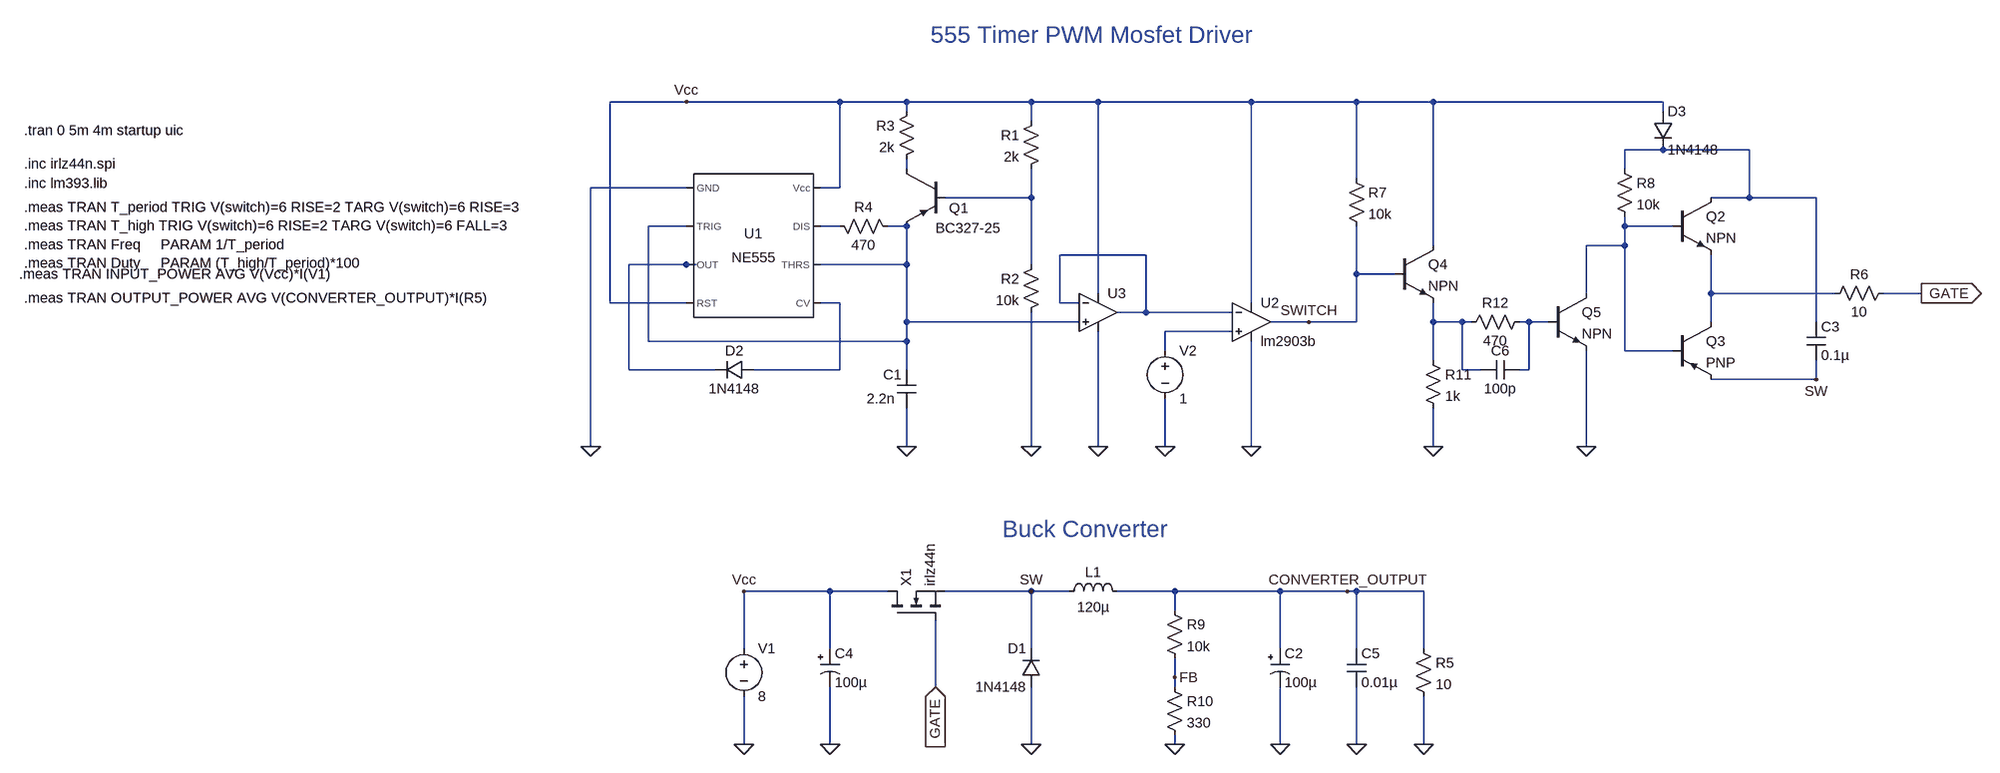
[diagram p0: schematic buck-converter.asc]
buck-converter.asc, the LTspice schematic file:
Version 4.1
SHEET 1 2688 1764
WIRE 320 64 192 64
WIRE 576 64 320 64
WIRE 688 64 576 64
WIRE 896 64 688 64
WIRE 1008 64 896 64
WIRE 1264 64 1008 64
WIRE 1440 64 1264 64
WIRE 1568 64 1440 64
WIRE 1952 64 1568 64
WIRE 688 80 688 64
WIRE 1952 80 1952 64
WIRE 896 96 896 64
WIRE 1952 144 1888 144
WIRE 2096 144 1952 144
WIRE 688 176 688 160
WIRE 1888 176 1888 144
WIRE 1440 192 1440 64
WIRE 320 208 160 208
WIRE 576 208 576 64
WIRE 576 208 544 208
WIRE 896 224 896 176
WIRE 896 224 752 224
WIRE 2096 224 2096 144
WIRE 2096 224 2032 224
WIRE 2208 224 2096 224
WIRE 320 272 256 272
WIRE 576 272 544 272
WIRE 688 272 656 272
WIRE 1888 272 1888 256
WIRE 1968 272 1888 272
WIRE 1568 304 1568 64
WIRE 1888 304 1888 272
WIRE 1888 304 1824 304
WIRE 1088 320 944 320
WIRE 320 336 224 336
WIRE 336 336 320 336
WIRE 688 336 688 272
WIRE 688 336 544 336
WIRE 896 336 896 224
WIRE 1440 352 1440 272
WIRE 1504 352 1440 352
WIRE 1008 384 1008 64
WIRE 1824 384 1824 304
WIRE 2032 384 2032 320
WIRE 2240 384 2032 384
WIRE 2384 384 2320 384
WIRE 192 400 192 64
WIRE 320 400 192 400
WIRE 576 400 544 400
WIRE 944 400 944 320
WIRE 976 400 944 400
WIRE 1264 400 1264 64
WIRE 1088 416 1088 320
WIRE 1088 416 1040 416
WIRE 1232 416 1088 416
WIRE 688 432 688 336
WIRE 976 432 688 432
WIRE 1360 432 1296 432
WIRE 1440 432 1440 352
WIRE 1440 432 1360 432
WIRE 1568 432 1568 400
WIRE 1616 432 1568 432
WIRE 1632 432 1616 432
WIRE 1728 432 1712 432
WIRE 1760 432 1728 432
WIRE 2032 432 2032 384
WIRE 2208 432 2208 224
WIRE 1232 448 1120 448
WIRE 256 464 256 272
WIRE 688 464 688 432
WIRE 688 464 256 464
WIRE 1120 480 1120 448
WIRE 1888 480 1888 304
WIRE 1968 480 1888 480
WIRE 1568 496 1568 432
WIRE 224 512 224 336
WIRE 368 512 224 512
WIRE 576 512 576 400
WIRE 576 512 432 512
WIRE 688 512 688 464
WIRE 1616 512 1616 432
WIRE 1648 512 1616 512
WIRE 1728 512 1728 432
WIRE 1728 512 1712 512
WIRE 2208 528 2208 496
WIRE 2208 528 2032 528
WIRE 160 640 160 208
WIRE 688 640 688 576
WIRE 896 640 896 416
WIRE 1008 640 1008 448
WIRE 1120 640 1120 560
WIRE 1264 640 1264 464
WIRE 1568 640 1568 576
WIRE 1824 640 1824 480
WIRE 560 992 416 992
WIRE 656 992 560 992
WIRE 896 992 752 992
WIRE 960 992 896 992
WIRE 1136 992 1040 992
WIRE 1312 992 1136 992
WIRE 1424 992 1312 992
WIRE 1440 992 1424 992
WIRE 1552 992 1440 992
WIRE 1136 1024 1136 992
WIRE 416 1088 416 992
WIRE 560 1088 560 992
WIRE 896 1088 896 992
WIRE 1312 1088 1312 992
WIRE 1440 1088 1440 992
WIRE 1552 1088 1552 992
WIRE 1136 1136 1136 1104
WIRE 736 1152 736 1040
WIRE 1136 1152 1136 1136
WIRE 416 1248 416 1168
WIRE 560 1248 560 1152
WIRE 896 1248 896 1152
WIRE 1136 1248 1136 1232
WIRE 1312 1248 1312 1152
WIRE 1440 1248 1440 1152
WIRE 1552 1248 1552 1168
FLAG 1312 1248 0
FLAG 1552 1248 0
FLAG 416 992 Vcc
FLAG 896 1248 0
FLAG 1136 1248 0
FLAG 1136 1136 FB
FLAG 1424 992 CONVERTER_OUTPUT
FLAG 416 1248 0
FLAG 1440 1248 0
FLAG 320 64 Vcc
FLAG 896 640 0
FLAG 1360 432 SWITCH
FLAG 688 640 0
FLAG 160 640 0
FLAG 1008 640 0
FLAG 1264 640 0
FLAG 1120 640 0
FLAG 2208 528 SW
FLAG 2384 384 GATE
IOPIN 2384 384 Out
FLAG 736 1152 GATE
IOPIN 736 1152 In
FLAG 896 992 SW
FLAG 1824 640 0
FLAG 560 1248 0
FLAG 1568 640 0
SYMBOL Misc\\NE555 432 304 R0
SYMATTR InstName U1
SYMBOL cap 704 512 M0
WINDOW 3 35 48 Left 2
SYMATTR Value 2.2n
SYMATTR InstName C1
SYMBOL ind 944 1008 R270
WINDOW 0 32 56 VTop 2
WINDOW 3 5 56 VBottom 2
SYMATTR InstName L1
SYMATTR Value 120µ
SYMATTR SpiceLine Rser=1m
SYMBOL polcap 1296 1088 R0
SYMATTR InstName C2
SYMATTR Value 100µ
SYMBOL res 1536 1072 R0
SYMATTR InstName R5
SYMATTR Value 10
SYMBOL nmos 656 1040 R270
SYMATTR InstName X1
SYMATTR Value irlz44n
SYMATTR Prefix X
SYMBOL diode 912 1152 R180
WINDOW 0 24 64 Left 2
WINDOW 3 24 0 Left 2
SYMATTR InstName D1
SYMATTR Value 1N4148
SYMATTR Description Schottky diode
SYMATTR Type schottky
SYMBOL res 1120 1008 R0
SYMATTR InstName R9
SYMATTR Value 10k
SYMBOL res 1120 1136 R0
SYMATTR InstName R10
SYMATTR Value 330
SYMBOL voltage 416 1072 R0
WINDOW 123 0 0 Left 0
WINDOW 39 0 0 Left 0
SYMATTR InstName V1
SYMATTR Value 8
SYMBOL cap 1424 1088 R0
SYMATTR InstName C5
SYMATTR Value 0.01µ
SYMBOL pnp 752 176 M0
WINDOW 0 -39 66 Left 2
WINDOW 3 -93 99 Left 2
SYMATTR InstName Q1
SYMATTR Value BC327-25
SYMBOL res 912 320 M0
SYMATTR InstName R2
SYMATTR Value 10k
SYMBOL res 912 80 M0
SYMATTR InstName R1
SYMATTR Value 2k
SYMBOL OpAmps\\opamp2 1264 368 R0
SYMATTR InstName U2
SYMATTR Value lm2903b
SYMBOL res 1424 176 R0
SYMATTR InstName R7
SYMATTR Value 10k
SYMBOL res 704 64 M0
SYMATTR InstName R3
SYMATTR Value 2k
SYMBOL OpAmps\\UniversalOpAmp1 1008 416 R0
SYMATTR InstName U3
SYMBOL res 560 256 M90
WINDOW 0 0 56 VBottom 2
WINDOW 3 32 56 VTop 2
SYMATTR InstName R4
SYMATTR Value 470
SYMBOL diode 432 528 M270
WINDOW 0 32 32 VTop 2
WINDOW 3 0 32 VBottom 2
SYMATTR InstName D2
SYMATTR Value 1N4148
SYMATTR Description Schottky diode
SYMATTR Type schottky
SYMBOL voltage 1120 464 R0
WINDOW 123 0 0 Left 0
WINDOW 39 0 0 Left 0
SYMATTR InstName V2
SYMATTR Value 1
SYMBOL npn 1968 224 R0
SYMATTR InstName Q2
SYMBOL cap 2192 432 R0
SYMATTR InstName C3
SYMATTR Value 0.1µ
SYMBOL res 2336 368 R90
WINDOW 0 0 56 VBottom 2
WINDOW 3 32 56 VTop 2
SYMATTR InstName R6
SYMATTR Value 10
SYMBOL pnp 1968 432 R0
SYMATTR InstName Q3
SYMBOL npn 1504 304 R0
SYMATTR InstName Q4
SYMBOL res 1872 160 R0
SYMATTR InstName R8
SYMATTR Value 10k
SYMBOL diode 1936 80 R0
SYMATTR InstName D3
SYMATTR Value 1N4148
SYMBOL npn 1760 384 R0
SYMATTR InstName Q5
SYMBOL res 1552 480 R0
SYMATTR InstName R11
SYMATTR Value 1k
SYMBOL res 1728 416 R90
WINDOW 0 0 56 VBottom 2
WINDOW 3 32 56 VTop 2
SYMATTR InstName R12
SYMATTR Value 470
SYMBOL polcap 544 1088 R0
SYMATTR InstName C4
SYMATTR Value 100µ
SYMBOL cap 1712 496 R90
WINDOW 0 0 32 VBottom 2
WINDOW 3 32 32 VTop 2
SYMATTR InstName C6
SYMATTR Value 100p
TEXT -1304 112 Left 2 !.tran 0 5m 4m startup uic
TEXT -1304 240 Left 2 !.meas TRAN T_period TRIG V(switch)=6 RISE=2 TARG V(switch)=6 RISE=3\n.meas TRAN T_high TRIG V(switch)=6 RISE=2 TARG V(switch)=6 FALL=3\n.meas TRAN Freq     PARAM 1/T_period\n.meas TRAN Duty     PARAM (T_high/T_period)*100
TEXT -1312 352 Left 2 !.meas TRAN INPUT_POWER AVG V(Vcc)*I(V1)
TEXT -1304 168 Left 2 !.inc irlz44n.spi
TEXT -1304 200 Left 2 !.inc lm393.lib
TEXT 848 888 Left 4 ;Buck Converter
TEXT 728 -48 Left 4 ;555 Timer PWM Mosfet Driver
TEXT -1304 392 Left 2 !.meas TRAN OUTPUT_POWER AVG V(CONVERTER_OUTPUT)*I(R5)

The netlist it stands for:
* buck-converter.asc
X§U1 0 N004 N008 Vcc N010 N004 N005 Vcc NE555  ; pins GND TRIG OUT RST CV THRS DIS Vcc
C1 N004 0 2.2n
L1 SW CONVERTER_OUTPUT 120µ Rser=1m
C2 CONVERTER_OUTPUT 0 100µ
R5 CONVERTER_OUTPUT 0 10
X§X1 Vcc GATE SW irlz44n  ; pins D G S
D1 0 SW 1N4148
R9 CONVERTER_OUTPUT FB 10k
R10 FB 0 330
V1 Vcc 0 8
C5 CONVERTER_OUTPUT 0 0.01µ
Q1 N002 N003 N004 0 BC327-25
R2 N003 0 10k
R1 Vcc N003 2k
X§U2 N013 N007 Vcc 0 SWITCH lm2903b  ; pins In+ In- V+ V- OUT
R7 Vcc SWITCH 10k
R3 Vcc N002 2k
X§U3 N004 N007 Vcc 0 N007 level1 Avol=1Meg GBW=10Meg Vos=0 En=0 Enk=0 In=0 Ink=0 Rin=500Meg  ; pins In+ In- V+ V- OUT
R4 N005 N004 470
D2 N010 N008 1N4148
V2 N013 0 1
Q2 N001 N006 N009 0 NPN
C3 N001 SW 0.1µ
R6 GATE N009 10
Q3 N009 N006 SW 0 PNP
Q4 Vcc SWITCH N011 0 NPN
R8 N001 N006 10k
D3 Vcc N001 1N4148
Q5 N006 N012 0 0 NPN
R11 N011 0 1k
R12 N012 N011 470
C4 Vcc 0 100µ
C6 N012 N011 100p
.model D D
.lib standard.dio
.model NPN NPN
.model PNP PNP
.lib standard.bjt
.tran 0 5m 4m startup uic
.meas TRAN T_period TRIG V(switch)=6 RISE=2 TARG V(switch)=6 RISE=3
.meas TRAN T_high TRIG V(switch)=6 RISE=2 TARG V(switch)=6 FALL=3
.meas TRAN Freq     PARAM 1/T_period
.meas TRAN Duty     PARAM (T_high/T_period)*100
.meas TRAN INPUT_POWER AVG V(Vcc)*I(V1)
.inc irlz44n.spi
.inc lm393.lib
* Buck Converter
* 555 Timer PWM Mosfet Driver
.meas TRAN OUTPUT_POWER AVG V(CONVERTER_OUTPUT)*I(R5)
.lib NE555.sub
.lib UniversalOpAmp1.lib
.backanno
.end